# Altium project S7.PrjPCB (part 2 of 3)

## Sheet S7_RF.SchDoc
size A3
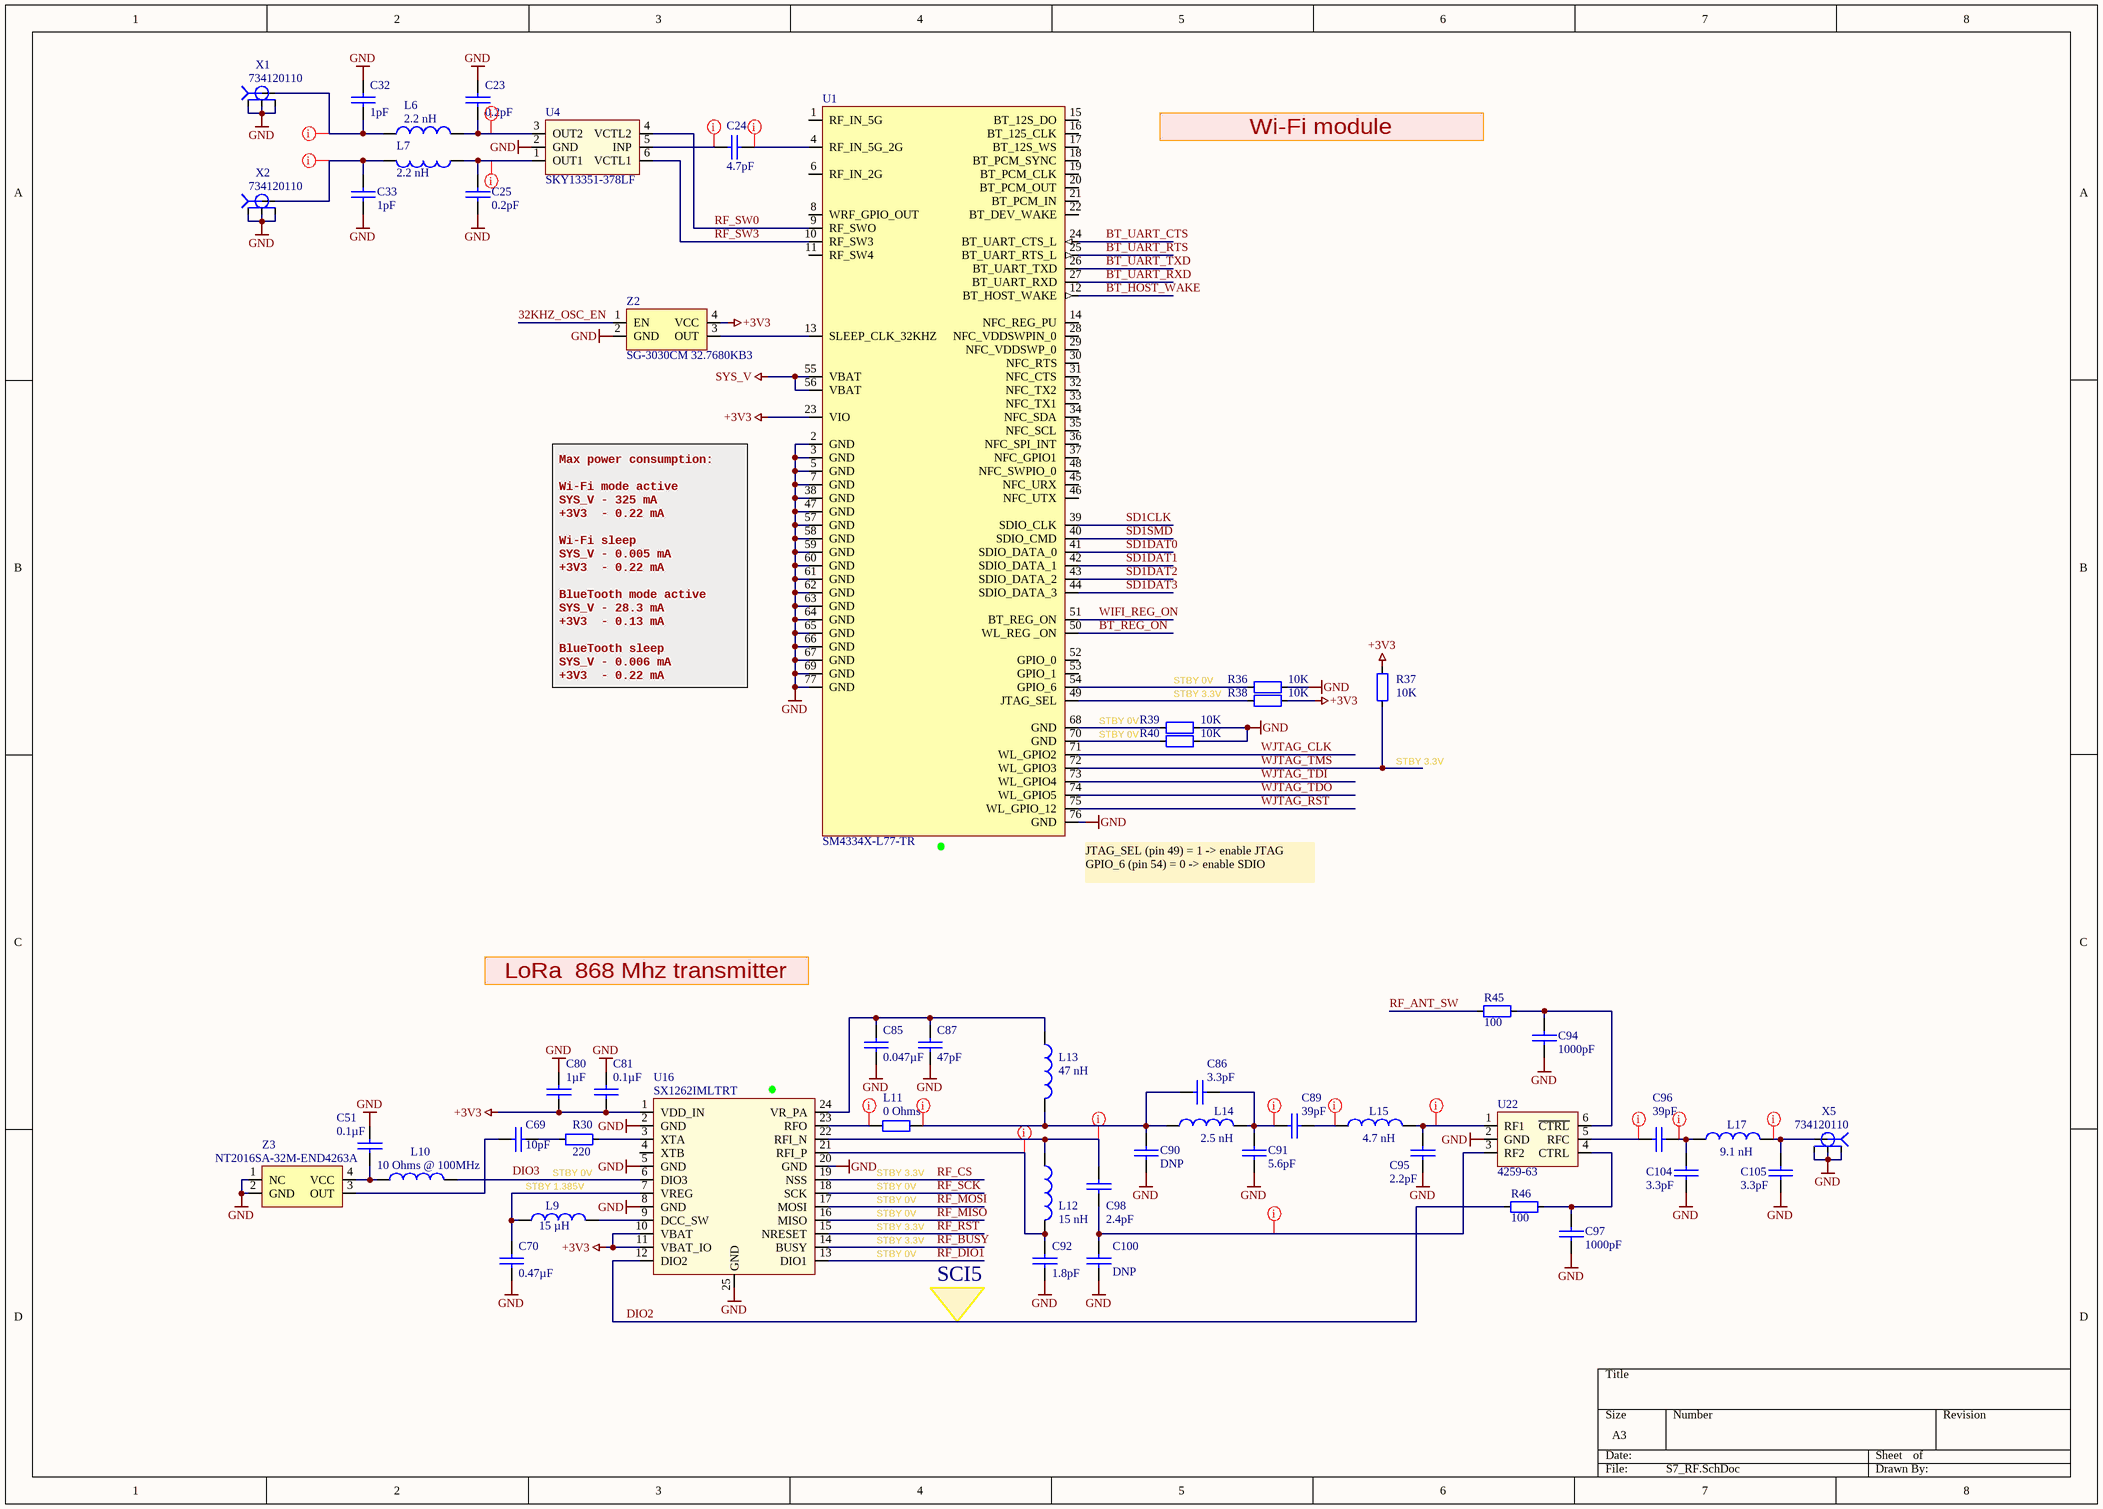
[diagram p2: S7_RF.SchDoc]

### Parts
C23  value 0.2pF  [0402 CAP]  (hidden comment: Capacitor)
C24  value 4.7pF  [0402 CAP]  (hidden comment: Capacitor)
C25  value 0.2pF  [0402 CAP]  (hidden comment: Capacitor)
C32  value 1pF  [0402 CAP]  (hidden comment: Capacitor)
C33  value 1pF  [0402 CAP]  (hidden comment: Capacitor)
C51  value 0.1µF  [0402 CAP]  (hidden comment: Capacitor)
C69  value 10pF  [0402 CAP]  (hidden comment: Capacitor)
C70  value 0.47µF  [0402 CAP]  (hidden comment: Capacitor)
C80  value 1µF  [0402 CAP]  (hidden comment: Capacitor)
C81  value 0.1µF  [0402 CAP]  (hidden comment: Capacitor)
C85  value 0.047µF  [0402 CAP]  (hidden comment: Capacitor)
C86  value 3.3pF  [0402 CAP]  (hidden comment: Capacitor)
C87  value 47pF  [0402 CAP]  (hidden comment: Capacitor)
C89  value 39pF  [0402 CAP]  (hidden comment: Capacitor)
C90  value DNP  [0402 CAP]  (hidden comment: Capacitor_0402)  (no BOM)
C91  value 5.6pF  [0402 CAP]  (hidden comment: Capacitor)
C92  value 1.8pF  [0402 CAP]  (hidden comment: Capacitor)
C94  value 1000pF  [0402 CAP]  (hidden comment: Capacitor)
C95  value 2.2pF  [0402 CAP]  (hidden comment: Capacitor)
C96  value 39pF  [0402 CAP]  (hidden comment: Capacitor)
C97  value 1000pF  [0402 CAP]  (hidden comment: Capacitor)
C98  value 2.4pF  [0402 CAP]  (hidden comment: Capacitor)
C100  value DNP  [0402 CAP]  (hidden comment: Capacitor_0402)  (no BOM)
C104  value 3.3pF  [0402 CAP]  (hidden comment: Capacitor)
C105  value 3.3pF  [0402 CAP]  (hidden comment: Capacitor)
L6  value 2.2 nH  [INDC1005-0402]  (hidden comment: LQP15MN2N2B02D)
L7  value 2.2 nH  [INDC1005-0402]  (hidden comment: LQP15MN2N2B02D)
L9  value 15 µH  [2012[0805]]  (hidden comment: MLZ2012M150WT000)
L10  value 10 Ohms @ 100MHz  [INDC1005-0402]  (hidden comment: BLM15PG100SN1D)
L11  value 0 Ohms  [INDC1005-0402]  (hidden comment: CRCW04020000Z0ED)
L12  value 15 nH  [INDC1005-0402]  (hidden comment: LQW15AN15NH00D)
L13  value 47 nH  [INDC1005-0402]  (hidden comment: LQW15AN47NJ00D)
L14  value 2.5 nH  [INDC1005-0402]  (hidden comment: LQW15AN2N5C00D)
L15  value 4.7 nH  [INDC1005-0402]  (hidden comment: LQW15AN4N7C00D)
L17  value 9.1 nH  [INDC1005-0402]  (hidden comment: LQW15AN9N1H00D)
R30  value 220  [0402]  (hidden comment: Resistor)
R36  value 10K  [0402]  (hidden comment: MCR01MZPJ103)
R37  value 10K  [0402]  (hidden comment: MCR01MZPJ103)
R38  value 10K  [0402]  (hidden comment: MCR01MZPJ103)
R39  value 10K  [0402]  (hidden comment: MCR01MZPJ103)
R40  value 10K  [0402]  (hidden comment: MCR01MZPJ103)
R45  value 100  [0402]  (hidden comment: Resistor)
R46  value 100  [0402]  (hidden comment: Resistor)
U1  SM4334X-L77-TR  [ISM43340-L77-TR]
U4  SKY13351-378LF  [SKY13351-378LF]
U16  SX1262IMLTRT  [VQFN24]
U22  4196  [SC70-6]  (value not drawn)
X1  734120110  [0734120110]
X2  734120110  [0734120110]
X5  734120110  [0734120110]
Z2  SG-3030CM 32.7680KB3  [SG-3030CM]
Z3  NT2016SA-32M-END4263A  [4-SMD 2.00mm x 1.60mm]

### Nets
+3V3: C80.2 C81.2 R37.2 R38.1 U1.23(VIO) U16.1(VDD_IN) U16.10(VBAT) U16.11(VBAT_IO) Z2.4(VCC)
GND: C23.1 C25.1 C32.1 C33.1 C51.1 C70.2 C80.1 C81.1 C85.2 C87.2 C90.2 C91.2 C92.2 C94.1 C95.2 C97.1 C100.2 C104.1 C105.1 R36.1 R39.1 R40.1 U1.2(GND) U1.3(GND) U1.5(GND) U1.7(GND) U1.38(GND) U1.47(GND) U1.57(GND) U1.58(GND) U1.59(GND) U1.60(GND) U1.61(GND) U1.62(GND) U1.63(GND) U1.64(GND) U1.65(GND) U1.66(GND) U1.67(GND) U1.69(GND) U1.76(GND) U1.77(GND) U4.2(GND) U16.2(GND) U16.5(GND) U16.8(GND) U16.20(GND) U16.25(GND) U22.2(GND) X1.2 X1.3 X1.4 X2.2 X2.3 X2.4 X5.2 X5.3 X5.4 Z2.2(GND) Z3.1(NC) Z3.2(GND)
SYS_V: U1.55(VBAT) U1.56(VBAT)
32KHZ_OSC_EN: Z2.1(EN)
BT_HOST_WAKE: U1.12(BT_HOST_WAKE)
BT_REG_ON: U1.50(WL_REG__ON)
BT_UART_CTS: U1.24(BT_UART_CTS_L)
BT_UART_RTS: U1.25(BT_UART_RTS_L)
BT_UART_RXD: U1.27(BT_UART_RXD)
BT_UART_TXD: U1.26(BT_UART_TXD)
DIO2: R46.2 U16.12(DIO2)
RF_ANT_SW: R45.2
RF_BUSY: U16.14(BUSY)
RF_CS: U16.19(NSS)
RF_DIO1: U16.13(DIO1)
RF_MISO: U16.16(MISO)
RF_MOSI: U16.17(MOSI)
RF_RST: U16.15(NRESET)
RF_SCK: U16.18(SCK)
RF_SW0: U1.9(RF_SWO) U4.4(VCTL2)
RF_SW3: U1.10(RF_SW3) U4.6(VCTL1)
SD1CLK: U1.39(SDIO_CLK)
SD1DAT0: U1.41(SDIO_DATA_0)
SD1DAT1: U1.42(SDIO_DATA_1)
SD1DAT2: U1.43(SDIO_DATA_2)
SD1DAT3: U1.44(SDIO_DATA_3)
SD1SMD: U1.40(SDIO_CMD)
WIFI_REG_ON: U1.51(BT_REG_ON)
WJTAG_CLK: U1.71(WL_GPIO2)
WJTAG_RST: U1.75(WL_GPIO_12)
WJTAG_TDI: U1.73(WL_GPIO4)
WJTAG_TDO: U1.74(WL_GPIO5)
WJTAG_TMS: R37.1 U1.72(WL_GPIO3)
NetC23_2: C23.2 L6.2 U4.3(OUT2)
NetC24_1: C24.1 U4.5(INP)
NetC24_2: C24.2 U1.4(RF_IN_5G_2G)
NetC25_2: C25.2 L7.2 U4.1(OUT1)
NetC32_2: C32.2 L6.1 X1.1(Sig)
NetC33_2: C33.2 L7.1 X2.1(Sig)
NetC51_2: C51.2 L10.1 Z3.4(VCC)
NetC69_1: C69.1 Z3.3(OUT)
NetC69_2: C69.2 R30.1
NetC70_1: C70.1 L9.1 U16.7(VREG)
NetC85_1: C85.1 C87.1 L13.1 U16.24(VR_PA)
NetC86_1: C86.1 C90.1 L11.2 L13.2 L14.1
NetC86_2: C86.2 C89.1 C91.1 L14.2
NetC89_2: C89.2 L15.1
NetC92_1: C92.1 L12.2 U16.21(RFI_P)
NetC94_2: C94.2 R45.1 U22.6(~{CTRL})
NetC95_1: C95.1 L15.2 U22.1(RF1)
NetC96_1: C96.1 U22.5(RFC)
NetC96_2: C96.2 C104.2 L17.1
NetC97_2: C97.2 R46.1 U22.4(CTRL)
NetC98_1: C98.1 L12.1 U16.22(RFI_N)
NetC98_2: C98.2 C100.1 U22.3(RF2)
NetC105_2: C105.2 L17.2 X5.1(Sig)
NetL9_2: L9.2 U16.9(DCC_SW)
NetL10_2: L10.2 U16.6(DIO3)
NetL11_1: L11.1 U16.23(RFO)
NetR30_2: R30.2 U16.3(XTA)
NetR36_2: R36.2 U1.54(GPIO_6)
NetR38_2: R38.2 U1.49(JTAG_SEL)
NetR39_2: R39.2 U1.68(GND)
NetR40_2: R40.2 U1.70(GND)
NetU1_13: U1.13(SLEEP_CLK_32KHZ) Z2.3(OUT)

Not connected (* = marked no-connect by the designer): U1 1(RF_IN_5G) 6(RF_IN_2G) 8(WRF_GPIO_OUT) 11(RF_SW4) 14(NFC_REG_PU) 15(BT_12S_DO) 16(BT_125_CLK) 17(BT_12S_WS) 18(BT_PCM_SYNC) 19(BT_PCM_CLK) 20(BT_PCM_OUT) 21(BT_PCM_IN) 22(BT_DEV_WAKE) 28(NFC_VDDSWPIN_0) 29(NFC_VDDSWP_0) 30(NFC_RTS) 31(NFC_CTS) 32(NFC_TX2) 33(NFC_TX1) 34(NFC_SDA) 35(NFC_SCL) 36(NFC_SPI_INT) 37(NFC_GPIO1) 45(NFC_URX) 46(NFC_UTX) 48(NFC_SWPIO_0) 52(GPIO_0) 53(GPIO_1); U16 4(XTB)

### Layout directives
net class RF: NetC23_2, NetC24_1, NetC24_2, NetC25_2, NetC32_2, NetC33_2, NetC86_1, NetC86_2, NetC89_2, NetC92_1, NetC95_1, NetC96_1, NetC96_2, NetC98_1, NetC98_2, NetC105_2, NetL11_1

### Notes on the sheet
- Wi-Fi module
- Max power consumption:
  Wi-Fi mode active
  SYS_V - 325 mA
  +3V3  - 0.22 mA
  Wi-Fi sleep
  SYS_V - 0.005 mA
  +3V3  - 0.22 mA
  BlueTooth mode active
  SYS_V - 28.3 mA
  +3V3  - 0.13 mA
  BlueTooth sleep
  SYS_V - 0.006 mA
  +3V3  - 0.22 mA
- STBY 0V
- STBY 3.3V
- (near U1) JTAG_SEL (pin 49) = 1 -> enable JTAG
  GPIO_6 (pin 54) = 0 -> enable SDIO
- LoRa  868 Mhz transmitter
- STBY 1.385V
- SCI5
- Labels drawn without touching a wire or pin: DIO3

### Library data of the parts
C23 C25 = 500R07S0R2BV4T: 0.2pF, ±0.1pF, 50V, C0G, NP0, 0402 (1005 Metric), -55°C ~ 125°C, High Q, Low Loss, Ultra Low ESR, RF, Microwave, High Frequency; Manufacturer: Johanson Technology Inc.; PartNum: 712-1160-1-ND; Voltage - Rated: 50V; Part Number: 500R07S0R2BV4T; Distributor: Digi-Key; PartName: 500R07S0R2BV4T; Price: 0.16000; Tolerance: ±0.1pF; Temperature Coefficient: C0G, NP0; Operating Temperature: -55°C ~ 125°C; Features: High Q, Low Loss, Ultra Low ESR; Package / Case: 0402 (1005 Metric)
C24 = 500R07S4R7CV4T: 4.7pF, ±0.25pF, 50V, C0G, NP0, 0402 (1005 Metric), -55°C ~ 125°C, High Q, Low Loss, Ultra Low ESR, RF, Microwave, High Frequency; Manufacturer: Johanson Technology Inc.; PartNum: 712-1287-1-ND; Voltage - Rated: 50V; Part Number: 500R07S4R7CV4T; Distributor: Digi-Key; PartName: 500R07S4R7CV4T; Price: 0.19000; Tolerance: ±0.25pF; Temperature Coefficient: C0G, NP0; Operating Temperature: -55°C ~ 125°C; Features: High Q, Low Loss, Ultra Low ESR; Package / Case: 0402 (1005 Metric)
C32 C33 = GJM1555C1H1R0CB01D: 1pF, ±0.25pF, 50V, C0G, NP0, 0402 (1005 Metric), -55°C ~ 125°C, High Q, Low Loss, RF, Microwave, High Frequency; Manufacturer: Murata Electronics North America; PartNum: 490-3083-1-ND; Voltage - Rated: 50V; Part Number: GJM1555C1H1R0CB01D; Distributor: Digi-Key; PartName: GJM1555C1H1R0CB01D; Price: 0.12000; Tolerance: ±0.25pF; Temperature Coefficient: C0G, NP0; Operating Temperature: -55°C ~ 125°C; Features: High Q, Low Loss; Package / Case: 0402 (1005 Metric)
C51 C81 = 0402B104K500CT: as C4 on sheet S7_Power; Voltage - Rated: 50V; Part Number: 0402B104K500CT; Distributor: Digi-Key; PartName: 0402B104K500CT; Price: 0.19000; Tolerance: ±10%; Temperature Coefficient: X7R; Operating Temperature: -55°C ~ 125°C; Features: -; Package / Case: 0402 (1005 Metric)
C69 = GJM1555C1H100FB01D: 10pF, ±1%, 50V, C0G, NP0, 0402 (1005 Metric), -55°C ~ 125°C, High Q, Low Loss, RF, Microwave, High Frequency; Manufacturer: Murata Electronics North America; PartNum: 490-11189-1-ND; Voltage - Rated: 50V; Part Number: GJM1555C1H100FB01D; Distributor: Digi-Key; PartName: GJM1555C1H100FB01D; Price: 0.28000; Tolerance: ±1%; Temperature Coefficient: C0G, NP0; Operating Temperature: -55°C ~ 125°C; Features: High Q, Low Loss; Package / Case: 0402 (1005 Metric)
C70 = GRT155R61E474ME01D: 0.47µF, ±20%, 25V, X5R, 0402 (1005 Metric), -55°C ~ 85°C, -, Automotive; Manufacturer: Murata Electronics North America; PartNum: 490-12270-1-ND; Voltage - Rated: 25V; Part Number: GRT155R61E474ME01D; Distributor: Digi-Key; PartName: GRT155R61E474ME01D; Price: 0.13000; Tolerance: ±20%; Temperature Coefficient: X5R; Operating Temperature: -55°C ~ 85°C; Features: -; Package / Case: 0402 (1005 Metric)
C80 = TMK105BJ105MV-F: 1µF, ±20%, 25V, X5R, 0402 (1005 Metric), -55°C ~ 85°C, -, General Purpose; Manufacturer: Taiyo Yuden; PartNum: 587-3245-1-ND; Voltage - Rated: 25V; Part Number: TMK105BJ105MV-F; Distributor: Digi-Key; PartName: TMK105BJ105MV-F; Price: 0.22000; Tolerance: ±20%; Temperature Coefficient: X5R; Operating Temperature: -55°C ~ 85°C; Features: -; Package / Case: 0402 (1005 Metric)
C85 = CC0402KRX7R8BB473: 0.047µF, ±10%, 25V, X7R, 0402 (1005 Metric), -55°C ~ 125°C, -, General Purpose; Manufacturer: Yageo; PartNum: 311-1717-1-ND; Voltage - Rated: 25V; Part Number: CC0402KRX7R8BB473; Distributor: Digi-Key; PartName: CC0402KRX7R8BB473; Price: 0.10000; Tolerance: ±10%; Temperature Coefficient: X7R; Operating Temperature: -55°C ~ 125°C; Features: -; Package / Case: 0402 (1005 Metric)
C86 C104 C105 = 885392005011: 3.3pF, ±0.1pF, 50V, C0G, NP0, 0402 (1005 Metric), -55°C ~ 125°C, -, RF, Microwave, High Frequency; Manufacturer: Wurth Electronics Inc.; PartNum: 732-13236-1-ND; Voltage - Rated: 50V; Part Number: 885392005011; Distributor: Digi-Key; PartName: 885392005011; Price: 0.10000; Tolerance: ±0.1pF; Temperature Coefficient: C0G, NP0; Operating Temperature: -55°C ~ 125°C; Features: -; Package / Case: 0402 (1005 Metric)
C87 = GJM1555C1H470FB01D: 47pF, ±1%, 50V, C0G, NP0, 0402 (1005 Metric), -55°C ~ 125°C, High Q, Low Loss, RF, Microwave, High Frequency; Manufacturer: Murata Electronics North America; PartNum: 490-16376-1-ND; Voltage - Rated: 50V; Part Number: GJM1555C1H470FB01D; Distributor: Digi-Key; PartName: GJM1555C1H470FB01D; Price: 0.28000; Tolerance: ±1%; Temperature Coefficient: C0G, NP0; Operating Temperature: -55°C ~ 125°C; Features: High Q, Low Loss; Package / Case: 0402 (1005 Metric)
C89 C96 = GJM1555C1H390JB01D: 39pF, ±5%, 50V, C0G, NP0, 0402 (1005 Metric), -55°C ~ 125°C, High Q, Low Loss, RF, Microwave, High Frequency; Manufacturer: Murata Electronics North America; PartNum: 490-17673-1-ND; Voltage - Rated: 50V; Part Number: GJM1555C1H390JB01D; Distributor: Digi-Key; PartName: GJM1555C1H390JB01D; Price: 0.24000; Tolerance: ±5%; Temperature Coefficient: C0G, NP0; Operating Temperature: -55°C ~ 125°C; Features: High Q, Low Loss; Package / Case: 0402 (1005 Metric)
C91 = GJM1555C1H5R6BB01D: 5.6pF, ±0.1pF, 50V, C0G, NP0, 0402 (1005 Metric), -55°C ~ 125°C, High Q, Low Loss, RF, Microwave, High Frequency; Manufacturer: Murata Electronics North America; PartNum: 490-11225-1-ND; Voltage - Rated: 50V; Part Number: GJM1555C1H5R6BB01D; Distributor: Digi-Key; PartName: GJM1555C1H5R6BB01D; Price: 0.19000; Tolerance: ±0.1pF; Temperature Coefficient: C0G, NP0; Operating Temperature: -55°C ~ 125°C; Features: High Q, Low Loss; Package / Case: 0402 (1005 Metric)
C92 = GJM1555C1H1R8BB01D: 1.8pF, ±0.1pF, 50V, C0G, NP0, 0402 (1005 Metric), -55°C ~ 125°C, High Q, Low Loss, RF, Microwave, High Frequency; Manufacturer: Murata Electronics North America; PartNum: 490-8089-1-ND; Voltage - Rated: 50V; Part Number: GJM1555C1H1R8BB01D; Distributor: Digi-Key; PartName: GJM1555C1H1R8BB01D; Price: 0.19000; Tolerance: ±0.1pF; Temperature Coefficient: C0G, NP0; Operating Temperature: -55°C ~ 125°C; Features: High Q, Low Loss; Package / Case: 0402 (1005 Metric)
C94 C97 = C1005CH1H102J050BA: 1000pF, ±5%, 50V, CH, 0402 (1005 Metric), -25°C ~ 85°C, Low ESL, General Purpose; Manufacturer: TDK Corporation; PartNum: 445-10829-1-ND; Voltage - Rated: 50V; Part Number: C1005CH1H102J050BA; Distributor: Digi-Key; PartName: C1005CH1H102J050BA; Price: 0.19000; Tolerance: ±5%; Temperature Coefficient: CH; Operating Temperature: -25°C ~ 85°C; Features: Low ESL; Package / Case: 0402 (1005 Metric)
C95 = CBR04C229B5GAC: 2.2pF, ±0.1pF, 50V, C0G, NP0, 0402 (1005 Metric), -55°C ~ 125°C, High Q, Low Loss, RF, Microwave, High Frequency; Manufacturer: KEMET; PartNum: 399-17527-1-ND; Voltage - Rated: 50V; Part Number: CBR04C229B5GAC; Distributor: Digi-Key; PartName: CBR04C229B5GAC; Price: 0.19000; Tolerance: ±0.1pF; Temperature Coefficient: C0G, NP0; Operating Temperature: -55°C ~ 125°C; Features: High Q, Low Loss; Package / Case: 0402 (1005 Metric)
C98 = GJM1555C1H2R4BB01D: 2.4pF, ±0.1pF, 50V, C0G, NP0, 0402 (1005 Metric), -55°C ~ 125°C, High Q, Low Loss, RF, Microwave, High Frequency; Manufacturer: Murata Electronics North America; PartNum: 490-8093-1-ND; Voltage - Rated: 50V; Part Number: GJM1555C1H2R4BB01D; Distributor: Digi-Key; PartName: GJM1555C1H2R4BB01D; Price: 0.19000; Tolerance: ±0.1pF; Temperature Coefficient: C0G, NP0; Operating Temperature: -55°C ~ 125°C; Features: High Q, Low Loss; Package / Case: 0402 (1005 Metric)
L6 L7 = LQP15MN2N2B02D: 2.2nH ±0.1nH, Q=13 @ 500MHz, 6GHz, Inductor 220mA 300 mOhm Max, -40°C ~ 85°C, 0402; Manufacturer: Murata Electronics North America; PartNum: 490-1128-1-ND; Tolerance: ±0.1nH; Distributor: Digi-Key; PartName: LQP15MN2N2B02D
L9 = MLZ2012M150WT000: 15µH Shielded Multilayer Inductor 250mA 950 mOhm 0805 (2012 Metric); Manufacturer: TDK Corporation; PartNum: 445-6397-1-ND; Tolerance: ±20%; Distributor: Digi-Key; Price: 0.14$; PartName: MLZ2012M150WT000
L10 = BLM15PG100SN1D: 10 Ohms @ 100MHz 1 Power Line Ferrite Bead 0402 (1005 Metric) 1A 25 mOhm; Manufacturer: Murata Electronics North America; PartNum: 490-5976-1-ND; Price: 0.12$; Distributor: Digi-Key; PartName: BLM15PG100SN1D
L11 = CRCW04020000Z0ED: 0 Ohms Jumper 0.063W, 1/16W Chip Resistor 0402 (1005 Metric) Automotive AEC-Q200 Thick Film; Manufacturer: Vishay Dale; PartNum: 541-0.0JCT-ND; Distributor: Digi-Key; PartName: CRCW04020000Z0ED
L12 = LQW15AN15NH00D: 15nH Unshielded Wirewound Inductor 460mA 160 mOhm Max 0402 (1006 Metric); Manufacturer: Murata; PartNum: 490-6772-1-ND; Tolerance: ±3%; Distributor: Digi-Key; PartName: LQW15AN15NH00D
L13 = LQW15AN47NJ00D: 47nH Unshielded Wirewound Inductor 210mA 1.08 Ohm Max 0402 (1005 Metric); Manufacturer: Murata; PartNum: 490-1154-1-ND; Tolerance: ±5%; Distributor: Digi-Key; PartName: LQW15AN47NJ00D
L14 = LQW15AN2N5C00D: 2.5nH Unshielded Wirewound Inductor 850mA 50 mOhm Max 0402 (1006 Metric); Manufacturer: Murata; PartNum: 490-6798-1-ND; Tolerance: ±0.2nH; Distributor: Digi-Key; PartName: LQW15AN2N5C00D
L15 = LQW15AN4N7C00D: 4.7nH Unshielded Wirewound Inductor 750mA 70 mOhm Max 0402 (1006 Metric); Manufacturer: Murata Electronics North America; PartNum: 490-1139-1-ND; Tolerance: ±0.2nH; Distributor: Digi-Key; PartName: LQW15AN4N7C00D
L17 = LQW15AN9N1H00D: 9.1nH Unshielded Wirewound Inductor 540mA 140 mOhm Max 0402 (1006 Metric); Manufacturer: Murata Electronics North America; PartNum: 490-8444-1-ND; Tolerance: ±3%; Distributor: Digi-Key; PartName: LQW15AN9N1H00D
R30 = RC0402FR-07220RL: 220 Ohms, ±1%, 0.063W, 1/16W, Thick Film, ±100ppm/°C, 0402 (1005 Metric), -55°C ~ 155°C, Moisture Resistant; Manufacturer: Yageo; PartNum: 311-220LRCT-ND; Voltage: 75V; Distributor: Digi-Key; Price: 0.10000; Tolerance: ±1%; PartName: RC0402FR-07220RL; Part Number: RC0402FR-07220RL; Temperature Coefficient: ±100ppm/°C; Operating Temperature: -55°C ~ 155°C; Power (Watts): 0.063W, 1/16W; Features: Moisture Resistant; Package / Case: 0402 (1005 Metric)
R36-R40 = MCR01MZPJ103: 10 K, 0402, Thick Film, -55..+155; Manufacturer: Rohm Semiconductor; PartNum: RHM10KJTR-ND; Tolerance: 5%; Distributor: Digi-Key; Price: 0.1$; PartName: MCR01MZPJ103
R45 R46 = RMCF0402FT100R: 100 Ohms, ±1%, 0.063W, 1/16W, Thick Film, ±100ppm/°C, 0402 (1005 Metric), -55°C ~ 155°C, Automotive AEC-Q200; Manufacturer: Stackpole Electronics Inc; PartNum: RMCF0402FT100RCT-ND; Voltage: 75V; Distributor: Digi-Key; Price: 0.10000; Tolerance: ±1%; PartName: RMCF0402FT100R; Part Number: RMCF0402FT100R; Temperature Coefficient: ±100ppm/°C; Operating Temperature: -55°C ~ 155°C; Power (Watts): 0.063W, 1/16W; Features: Automotive AEC-Q200; Package / Case: 0402 (1005 Metric)
U1 = SM4334X-L77-TR: Bluetooth, WiFi 802.11a/b/g/n, Bluetooth v4.0 Transceiver Module 2.4GHz, 5GHz Integrated, Trace + U.FL Surface Mount; PartNum: 1475-1047-1-ND; Nanufacturer: Inventek Systems; PartName: SM4334X-L77-TR; Distributor: Digi-Key
U4 = SKY13351-378LF: RF Switch IC 802.11/WiFi, WLAN SPDT 6GHz 50 Ohm, -40°C ~ 85°C, 6-MLPD (1x1); Manufacturer: Skyworks Solutions Inc.; PartNum: 863-1177-1-ND; Price: 089$; Distributor: Digi-Key; PartName: SKY13351-378LF
U16 = SX1262IMLTRT: IC RF TxRx Only General ISM < 1GHz LoRaWAN 150MHz ~ 960MHz 24-VFQFN Exposed Pad; Manufacturer: Semtech Corporation; PartName: SX1262IMLTRTCT-ND; Distributor: Digi-Key; PartNum: SX1262IMLTRT; Price: 7.94$
U22 = 4259-63: RF Switch IC General Purpose SPDT 3GHz 50 Ohm SC-70-6; Manufacturer: pSemi; PartNum: 1046-1011-2-ND; Distributor: Digi-Key; PartName: 4259-63
X1 X2 X5 = 0734120110: U.FL (UMCC) Connector Receptacle, Male Pin 50 Ohm Surface Mount Solder; Manufacturer: Molex; PartNum: WM5587TR-ND; Distributor: Digi-Key; PartName: 0734120110
Z2 = SG-3030CM 32.7680KB3: 32.768kHz XO (Standard) CMOS Oscillator 1.5V ~ 5.5V, -20°C ~ 70°C, 4-SMD  (3.20mm x 1.50mm); Manufacturer: EPSON; PartNum: SER4328CT-ND; Distributor: DigiKey; Price: 1.6$; Value: 32.768 kHz; PartName: SG-3030CM 32.7680KB3
Z3 = NT2016SA-32M-END4263A: 32MHz VCTCXO Oscillator 1.8V 4-SMD, No Lead; Manufacturer: NDK America, Inc.; PartNum: 644-1328-1-ND; Tolerance: ±2ppm; Distributor: Digi-Key; Price: 1.6$; Value: 32 MHz; PartName: NT2016SA-32M-END4263A

## Sheet S7_Audio_IMU_uSD.SchDoc
size A3
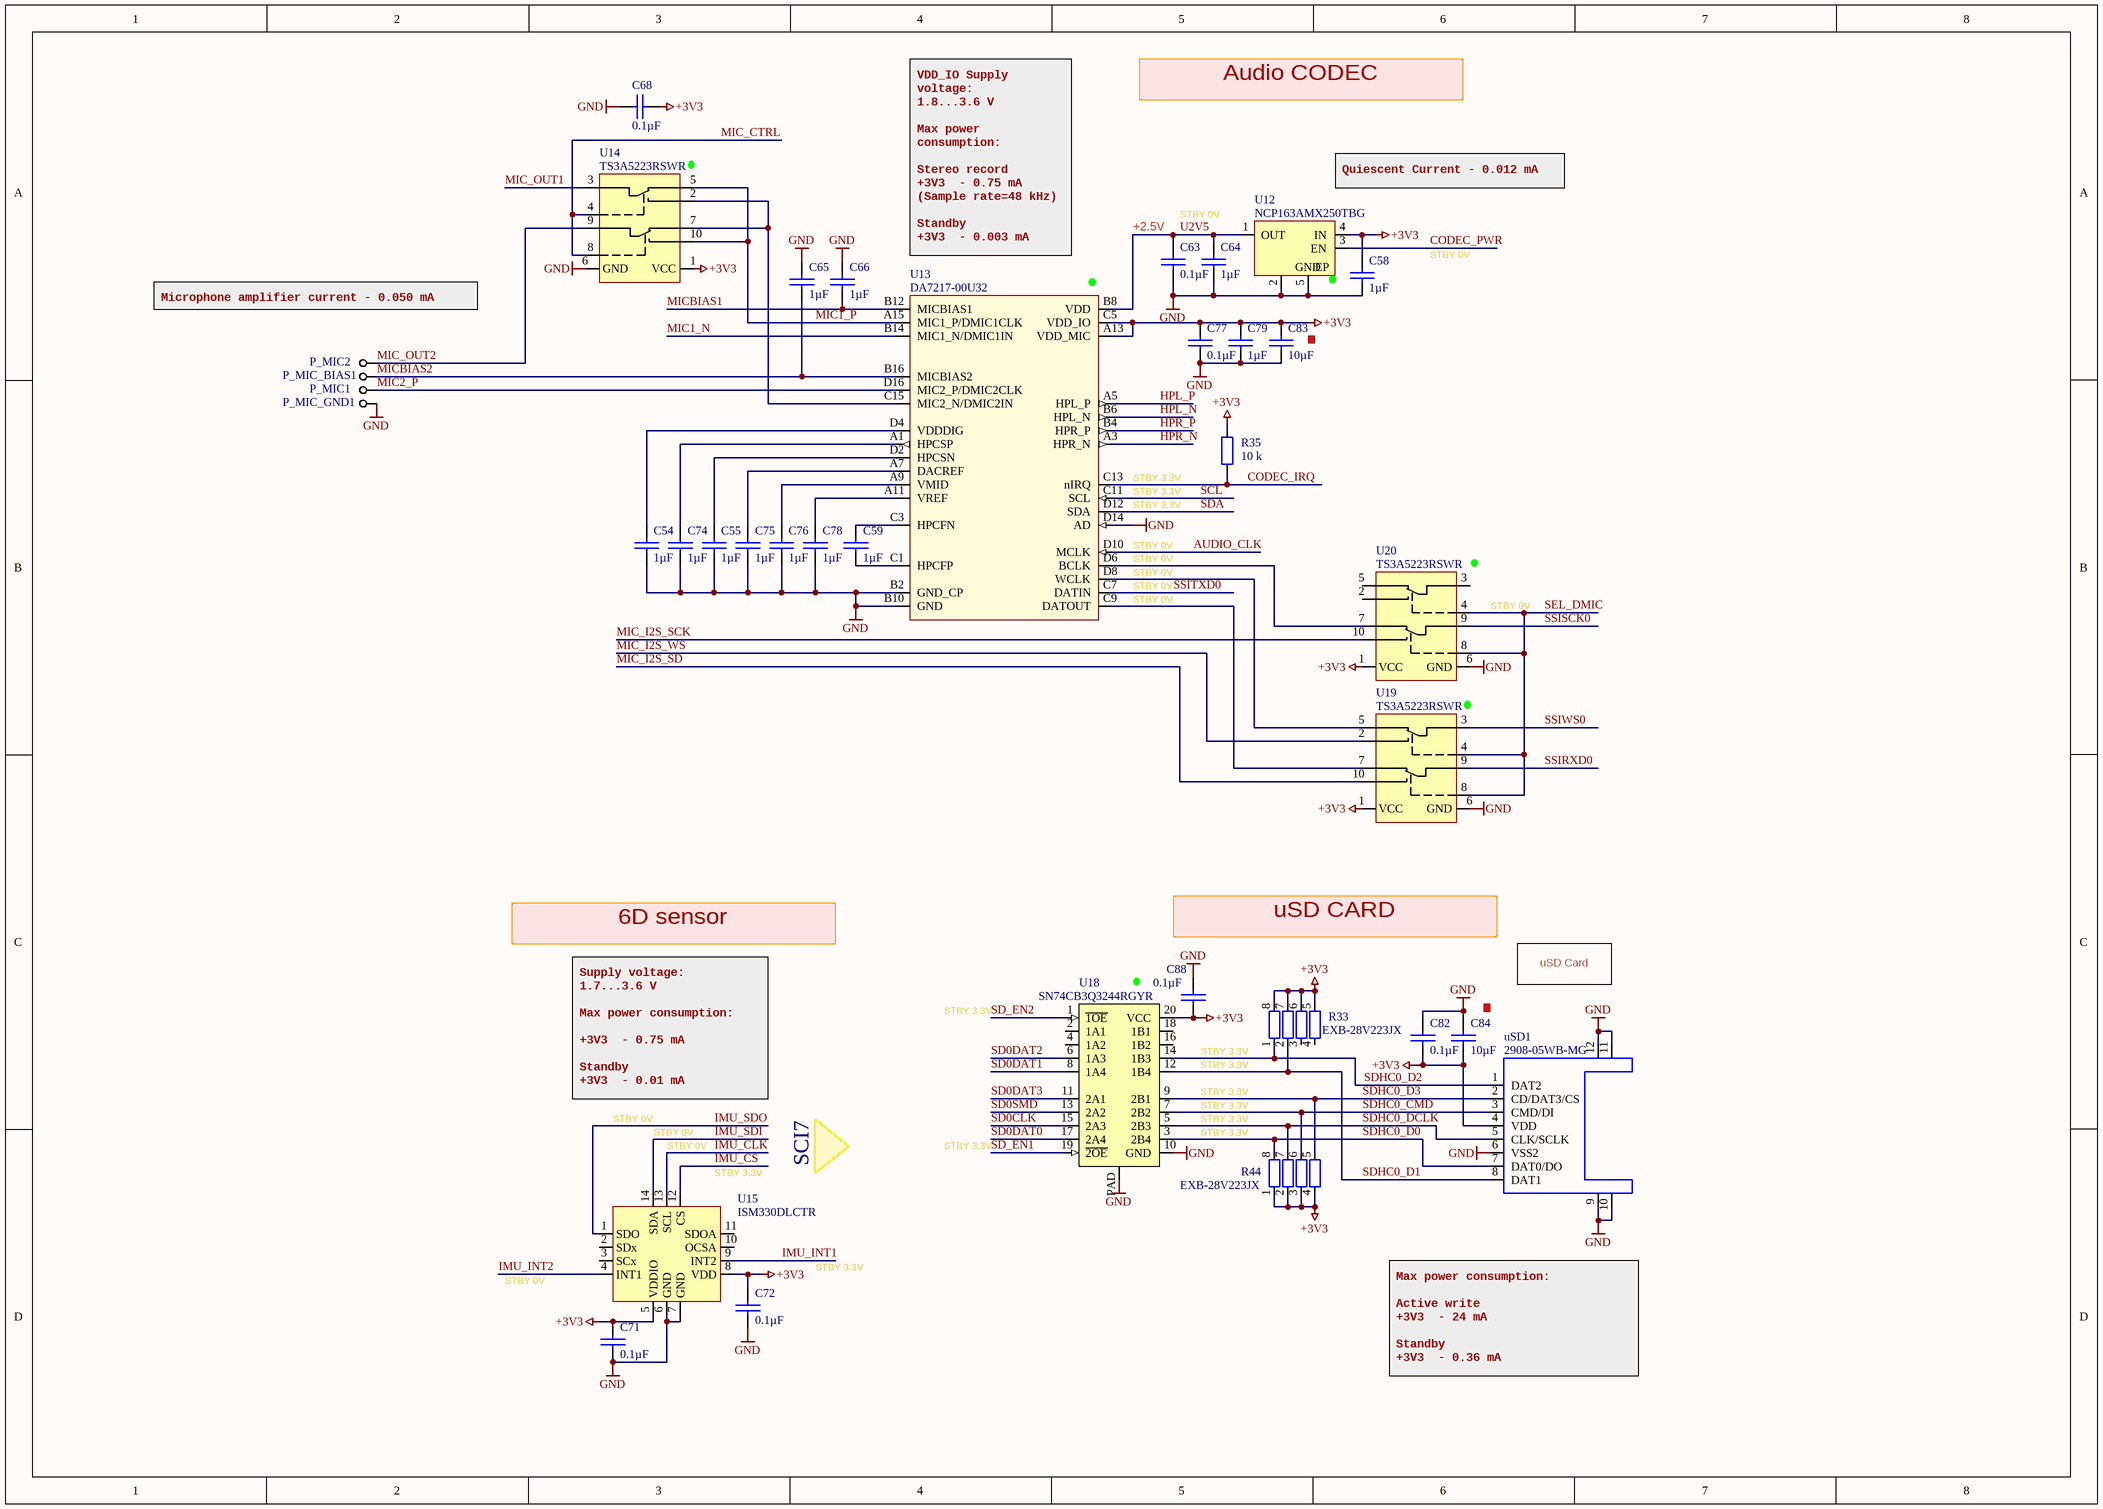
[diagram p3: S7_Audio_IMU_uSD.SchDoc]

### Parts
C54  value 1µF  [0402 CAP]  (hidden comment: Capacitor)
C55  value 1µF  [0402 CAP]  (hidden comment: Capacitor)
C58  value 1µF  [0402 CAP]  (hidden comment: Capacitor)
C59  value 1µF  [0402 CAP]  (hidden comment: Capacitor)
C63  value 0.1µF  [0402 CAP]  (hidden comment: Capacitor)
C64  value 1µF  [0402 CAP]  (hidden comment: Capacitor)
C65  value 1µF  [0402 CAP]  (hidden comment: Capacitor)
C66  value 1µF  [0402 CAP]  (hidden comment: Capacitor)
C68  value 0.1µF  [0402 CAP]  (hidden comment: Capacitor)
C71  value 0.1µF  [0402 CAP]  (hidden comment: Capacitor)
C72  value 0.1µF  [0402 CAP]  (hidden comment: Capacitor)
C74  value 1µF  [0402 CAP]  (hidden comment: Capacitor)
C75  value 1µF  [0402 CAP]  (hidden comment: Capacitor)
C76  value 1µF  [0402 CAP]  (hidden comment: Capacitor)
C77  value 0.1µF  [0402 CAP]  (hidden comment: Capacitor)
C78  value 1µF  [0402 CAP]  (hidden comment: Capacitor)
C79  value 1µF  [0402 CAP]  (hidden comment: Capacitor)
C82  value 0.1µF  [0402 CAP]  (hidden comment: Capacitor)
C83  value 10µF  [0603 CAP]  (hidden comment: Capacitor)
C84  value 10µF  [0603 CAP]  (hidden comment: Capacitor)
C88  value 0.1µF  [0402 CAP]  (hidden comment: Capacitor)
P_MIC1  PIN_TOP_1.5x2  [PIN_TOP_1.5x2]  (value not drawn)  (net tie, no BOM)
P_MIC2  PIN_TOP_1.5x2  [PIN_TOP_1.5x2]  (value not drawn)  (net tie, no BOM)
P_MIC_BIAS1  PIN_TOP_1.5x2  [PIN_TOP_1.5x2]  (value not drawn)  (net tie, no BOM)
P_MIC_GND1  PIN_TOP_1.5x2  [PIN_TOP_1.5x2]  (value not drawn)  (net tie, no BOM)
R33  EXB-28V223JX  [EXB28V 2x1 mm]
R35  value 10 k  [0402]  (hidden comment: Resistor)
R44  EXB-28V223JX  [EXB28V 2x1 mm]
U12  NCP163AMX250TBG  [4-XDFN]
U13  DA7217-00U32  [Dilaog 34-WLCSP (4.57x1.98)]
U14  TS3A5223RSWR  [uQFN-10]
U15  ISM330DLCTR  [LGA-14 BOSCH]
U18  SN74CB3Q3244RGYR  [TI_PVQFN-N20]
U19  TS3A5223RSWR  [uQFN-10]
U20  TS3A5223RSWR  [uQFN-10]
uSD1  2908-05WB-MG  [2908-05WB-MG]

### Nets
+3V3: C58.1 C68.2 C71.1 C72.1 C77.1 C79.1 C82.2 C83.1 C84.2 C88.2 R33.5 R33.6 R33.7 R33.8 R35.2 R44.1 R44.2 R44.3 R44.4 U12.4(IN) U13.A13(VDD_MIC) U13.C5(VDD_IO) U14.1(VCC) U15.5(VDDIO) U15.8(VDD) U18.20(VCC) U19.1(VCC) U20.1(VCC) uSD1.4(VDD)
GND: C54.2 C55.2 C58.2 C63.2 C64.2 C65.1 C66.1 C68.1 C71.2 C72.2 C74.2 C75.2 C76.2 C77.2 C78.2 C79.2 C82.1 C83.2 C84.1 C88.1 P_MIC_GND1.1 U12.2(GND) U12.5(EP) U13.B2(GND_CP) U13.B10(GND) U13.D14(AD) U14.6(GND) U15.6(GND) U15.7(GND) U18.10(GND) U18.PAD U19.6(GND) U20.6(GND) uSD1.6(VSS2) uSD1.9 uSD1.10(WP) uSD1.11(GND) uSD1.12(GND)
AUDIO_CLK: U13.D10(MCLK)
CODEC_IRQ: R35.1 U13.C13(nIRQ)
CODEC_PWR: U12.3(EN)
HPL_N: U13.B6(HPL_N)
HPL_P: U13.A5(HPL_P)
HPR_N: U13.A3(HPR_N)
HPR_P: U13.B4(HPR_P)
IMU_CLK: U15.13(SCL)
IMU_CS: U15.12(CS)
IMU_INT1: U15.9(INT2)
IMU_INT2: U15.4(INT1)
IMU_SDI: U15.14(SDA)
IMU_SDO: U15.1(SDO)
MIC1_N: U13.B14(MIC1_N/DMIC1IN)
MIC1_P: U13.A15(MIC1_P/DMIC1CLK) U14.5(NC1) U14.10(NO2)
MIC2_P: P_MIC1.1 U13.D16(MIC2_P/DMIC2CLK)
MIC_CTRL: U14.4(SEL1) U14.8(SEL2)
MIC_I2S_SCK: U20.10(NO2)
MIC_I2S_SD: U19.10(NO2)
MIC_I2S_WS: U19.2(NO1)
MIC_OUT1: U14.3(COM1)
MIC_OUT2: P_MIC2.1 U14.9(COM2)
MICBIAS1: C66.2 U13.B12(MICBIAS1)
MICBIAS2: C65.2 P_MIC_BIAS1.1 U13.B16(MICBIAS2)
SCL: U13.C11(SCL)
SD0CLK: U18.15(2A3)
SD0DAT0: U18.17(2A4)
SD0DAT1: U18.8(1A4)
SD0DAT2: U18.6(1A3)
SD0DAT3: U18.11(2A1)
SD0SMD: U18.13(2A2)
SD_EN1: U18.19(~{2OE})
SD_EN2: U18.1(~{1OE})
SDA: U13.D12(SDA)
SDHC0_CMD: R44.6 U18.7(2B2) uSD1.3(CMD/DI)
SDHC0_D0: R44.8 U18.3(2B4) uSD1.7(DAT0/DO)
SDHC0_D1: R33.2 U18.12(1B4) uSD1.8(DAT1)
SDHC0_D2: R33.1 U18.14(1B3) uSD1.1(DAT2)
SDHC0_D3: R44.5 U18.9(2B1) uSD1.2(CD/DAT3/CS)
SDHC0_DCLK: R44.7 U18.5(2B3) uSD1.5(CLK/SCLK)
SEL_DMIC: U19.4(SEL1) U19.8(SEL2) U20.4(SEL1) U20.8(SEL2)
SSIRXD0: U19.9(COM2)
SSISCK0: U20.9(COM2)
SSITXD0: U13.C7(DATIN)
SSIWS0: U19.3(COM1)
U2V5: C63.1 C64.1 U12.1(OUT) U13.B8(VDD)
NetC54_1: C54.1 U13.D4(VDDDIG)
NetC55_1: C55.1 U13.D2(HPCSN)
NetC59_1: C59.1 U13.C3(HPCFN)
NetC59_2: C59.2 U13.C1(HPCFP)
NetC74_1: C74.1 U13.A1(HPCSP)
NetC75_1: C75.1 U13.A7(DACREF)
NetC76_1: C76.1 U13.A9(VMID)
NetC78_1: C78.1 U13.A11(VREF)
NetU13_C9: U13.C9(DATOUT) U19.7(NC2)
NetU13_C15: U13.C15(MIC2_N/DMIC2IN) U14.2(NO1) U14.7(NC2)
NetU13_D6: U13.D6(BCLK) U20.7(NC2)
NetU13_D8: U13.D8(WCLK) U19.5(NC1)

Not connected (* = marked no-connect by the designer): R33 3 4; U15 2(SDx) 3(SCx) 10(OCSA) 11(SDOA); U18 2(1A1) 4(1A2) 16(1B2) 18(1B1); U20 2(NO1) 3(COM1) 5(NC1)

### Notes on the sheet
- Audio CODEC
- (near U12) Quiescent Current - 0.012 mA
- (near C63) +2.5V
- STBY 0V
- Microphone amplifier current - 0.050 mA
- VDD_IO Supply voltage:
  1.8...3.6 V
  Max power consumption:
  Stereo record
  +3V3  - 0.75 mA (Sample rate=48 kHz)
  Standby
  +3V3  - 0.003 mA
- (near U13) STBY 3.3V
- STBY 3.3V
- (near U13) STBY 0V
- (near U20) STBY 0V
- 6D sensor
- uSD CARD
- uSD Card
- Supply voltage:
  1.7...3.6 V
  Max power consumption:
  +3V3  - 0.75 mA
  Standby
  +3V3  - 0.01 mA
- (near U15) STBY 3.3V
- SCI7
- Max power consumption:
  Active write
  +3V3  - 24 mA
  Standby
  +3V3  - 0.36 mA

### Library data of the parts
C54 C55 C58 C59 C64-C66 C74-C76 C78 C79 = TMK105BJ105MV-F: as C80 on sheet S7_RF; Voltage - Rated: 25V; Part Number: TMK105BJ105MV-F; Distributor: Digi-Key; PartName: TMK105BJ105MV-F; Price: 0.22000; Tolerance: ±20%; Temperature Coefficient: X5R; Operating Temperature: -55°C ~ 85°C; Features: -; Package / Case: 0402 (1005 Metric)
C63 C68 C71 C72 C77 C82 C88 = 0402B104K500CT: as C4 on sheet S7_Power; Voltage - Rated: 50V; Part Number: 0402B104K500CT; Distributor: Digi-Key; PartName: 0402B104K500CT; Price: 0.19000; Tolerance: ±10%; Temperature Coefficient: X7R; Operating Temperature: -55°C ~ 125°C; Features: -; Package / Case: 0402 (1005 Metric)
C83 C84 = GRT188R61C106KE13D: as C1 on sheet S7_Power; Voltage - Rated: 16V; Part Number: GRT188R61C106KE13D; Distributor: Digi-Key; PartName: GRT188R61C106KE13D; Price: 0.22770; Tolerance: ±10%; Temperature Coefficient: X5R; Operating Temperature: -55°C ~ 85°C; Features: -; Package / Case: 0603 (1608 Metric)
P_MIC1 P_MIC2 P_MIC_BIAS1 P_MIC_GND1 = PIN_TOP_1.5x2: Pin on TOP layer 1.5 x 2 mm
R33 R44 = EXB-28V223JX: 22k Ohm ±5%,  4 Resistor, -55°C ~ 125°C,(2.00mm x 1.00mm); Manufacturer: Panasonic Electronic Components; PartNum: Y7223CT-ND; Distributor: Digi-Key; Price: 0.1$; Tolerance: 5%; Value: 22 k; PartName: EXB-28V223JX
R35 = RMCF0402FT10K0: 10 kOhms, ±1%, 0.063W, 1/16W, Thick Film, ±100ppm/°C, 0402 (1005 Metric), -55°C ~ 155°C, Automotive AEC-Q200; Manufacturer: Stackpole Electronics Inc; PartNum: RMCF0402FT10K0CT-ND; Voltage: 75V; Distributor: Digi-Key; Price: 0.10000; Tolerance: ±1%; PartName: RMCF0402FT10K0; Part Number: RMCF0402FT10K0; Temperature Coefficient: ±100ppm/°C; Operating Temperature: -55°C ~ 155°C; Power (Watts): 0.063W, 1/16W; Features: Automotive AEC-Q200; Package / Case: 0402 (1005 Metric)
U12 = NCP163AMX250TBG: LDO 2.5V, 250 mA, Vin < 5.5V, Iq < 20uA, -40..+125 C,  4-XDFN (1x1); Manufacturer: ON Semiconductor; PartNum: NCP163AMX250TBGOSCT-ND; Price: 0.41$; Distributor: Digi-Key; PartName: NCP163AMX250TBG
U13 = DA7217-00U32: Low power CODEC, 24 b, 2/2, I²C, I²S,  1.5V ~ 3.6V,  -25°C ~ 85°C, 34-WLCSP (4.57x1.98); Manufacturer: Dialog Semiconductor GmbH; PartNum: 1564-1043-1-ND; Price: 2.38$; Distributor: Digi-Key; PartName: DA7217-00U32
U14 U19 U20 = TS3A5223RSWR: 2 Circuit IC Switch 2:1 600 mOhm,-40°C ~ 85°C, 10-UQFN (1.8x1.4); Manufacturer: Texas Instruments; PartNum: 296-35687-1-ND; Distributor: Digi-Key; PartName: TS3A5223RSWR
U15 = ISM330DLCTR: Accelerometer, Gyroscope, Temperature, 3 Axis Sensor I²C, SPI , -40°C ~ 85°C, 14-LGA (2.5x3); Manufacturer: STMicroelectronics; PartNum: 497-17583-1-ND; Price: 6.28$; Distributor: Digi-Key; PartName: ISM330DLCTR
U18 = SN74CB3Q3244RGYR: Bus Switch 4 x 1:1, 2.3V ~ 3.6V,  -40°C ~ 85°C, 20-VQFN (3.5x4.5); Manufacturer: Texas Instruments; PartNum: 296-19127-1-ND; Distributor: Digi-Key; PartName: SN74CB3Q3244RGYR; Price: 1.08$
uSD1 = 2908-05WB-MG: microSD cadr holder; Manufacturer: Amphenol Commercial Products; PartNum: 101-00660-68-6-1-ND; PartName: 101-00660-68-6; Price: 1.97$; Distributor: Digi-Key

## Sheet S7_Misc.SchDoc
size A3
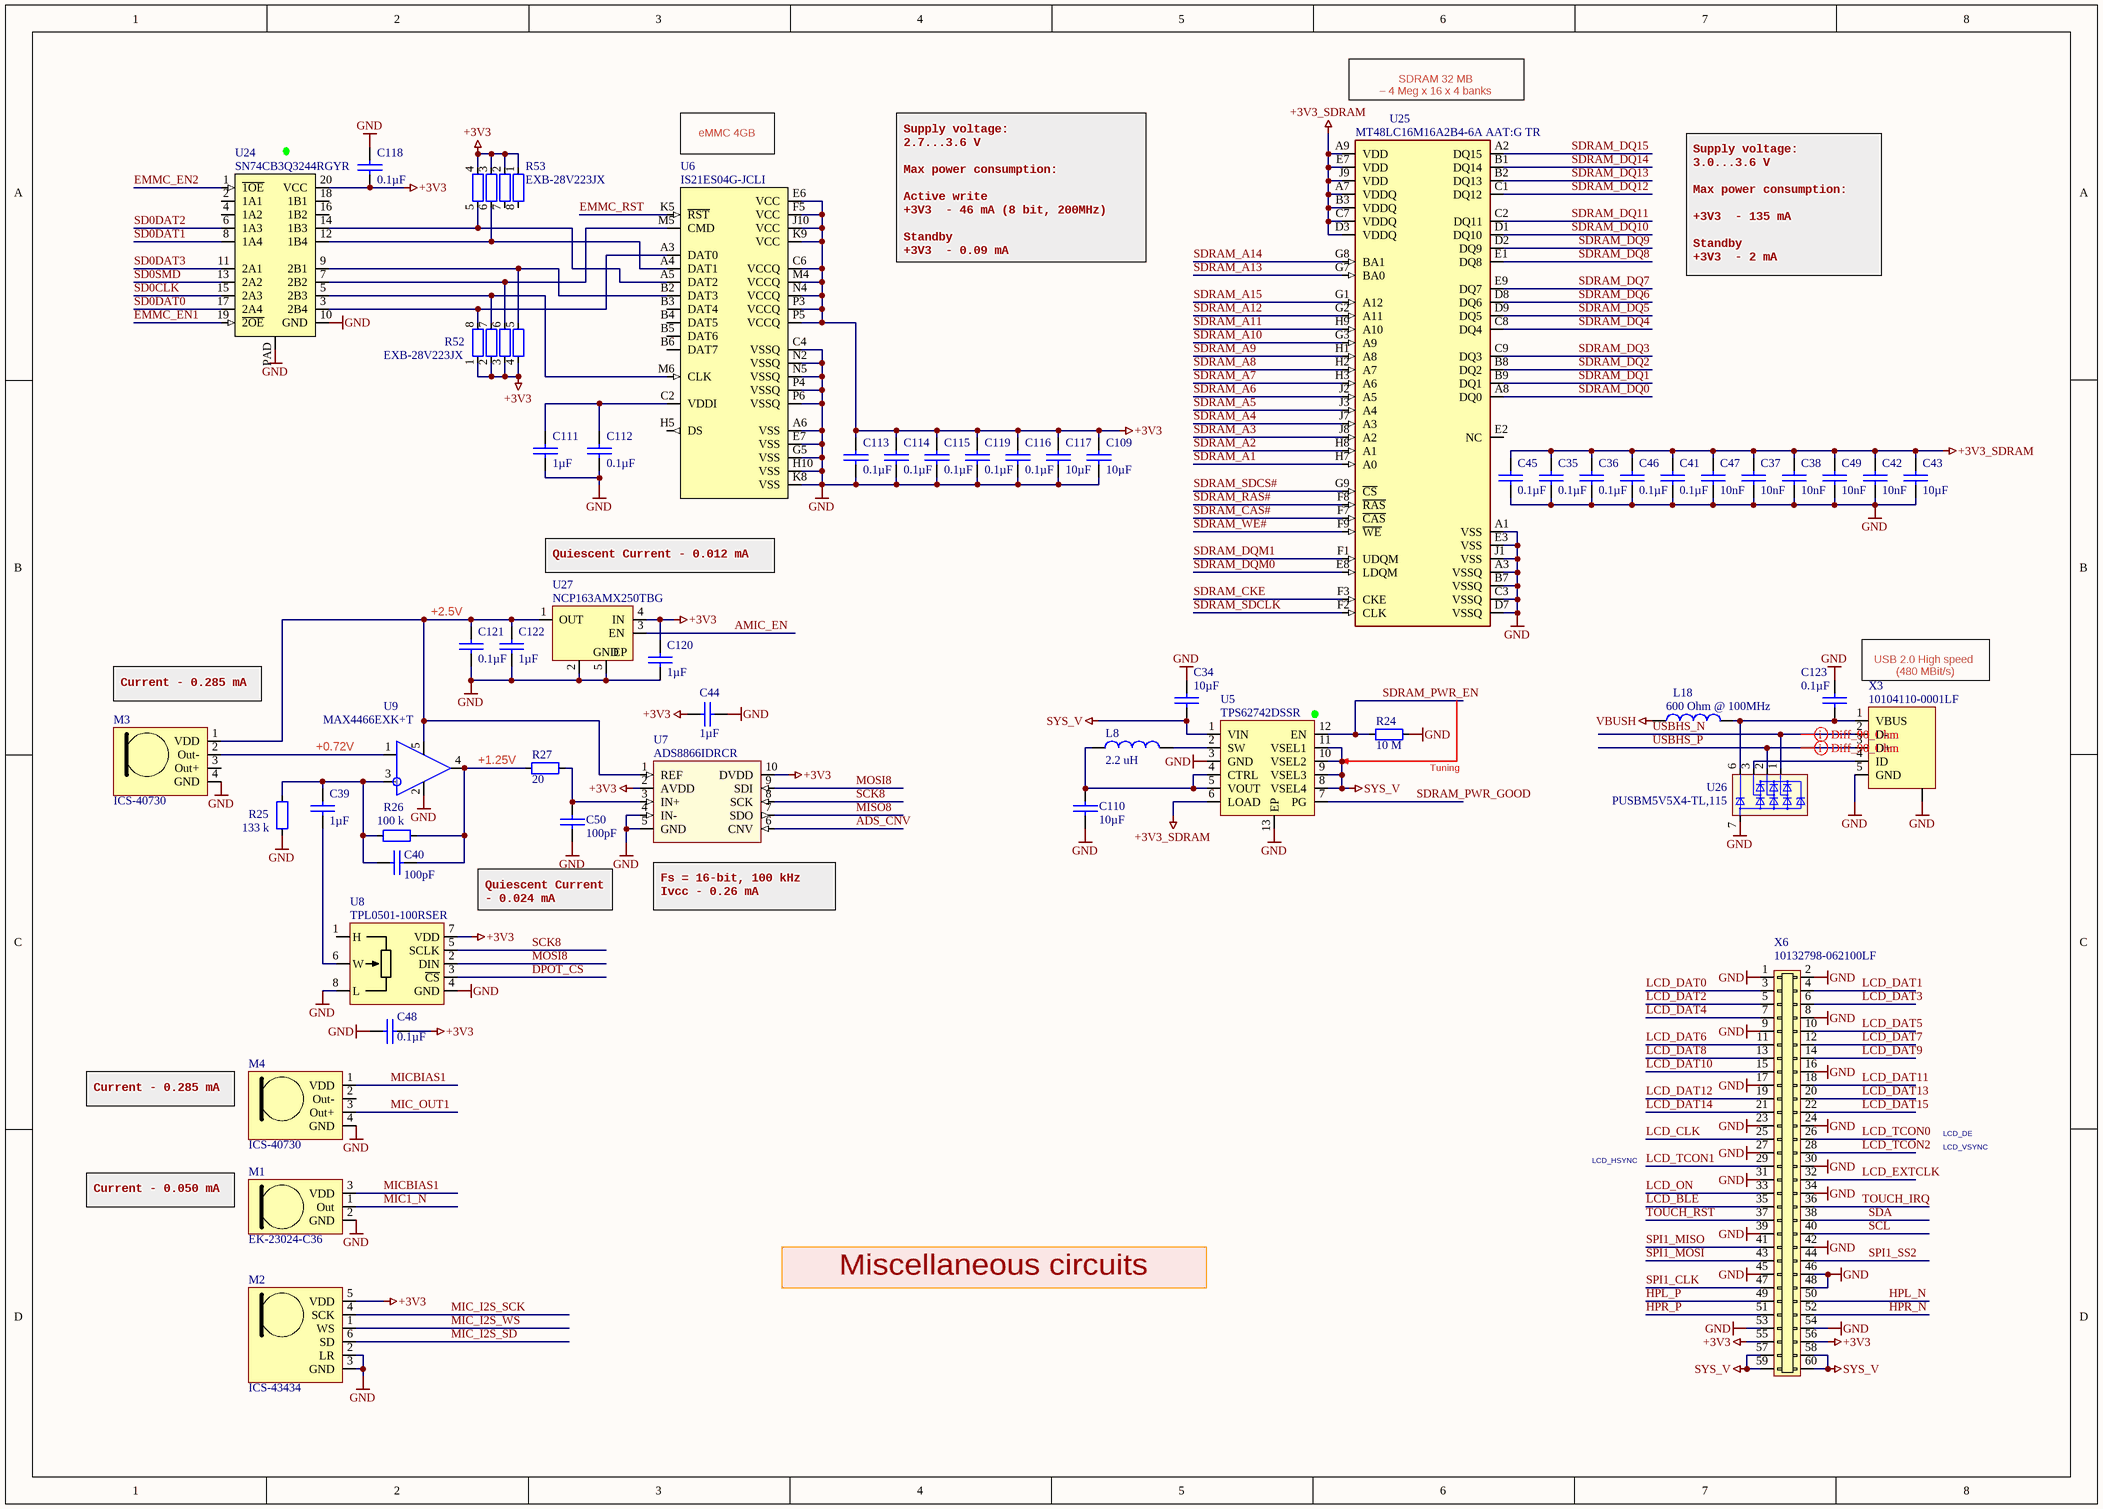
[diagram p4: S7_Misc.SchDoc]

### Parts
C34  value 10µF  [0603 CAP]  (hidden comment: Capacitor)
C35  value 0.1µF  [0402 CAP]  (hidden comment: Capacitor)
C36  value 0.1µF  [0402 CAP]  (hidden comment: Capacitor)
C37  value 10nF  [0402 CAP]  (hidden comment: Capacitor)
C38  value 10nF  [0402 CAP]  (hidden comment: Capacitor)
C39  value 1µF  [0402 CAP]  (hidden comment: Capacitor)
C40  value 100pF  [0402 CAP]  (hidden comment: Capacitor)
C41  value 0.1µF  [0402 CAP]  (hidden comment: Capacitor)
C42  value 10nF  [0402 CAP]  (hidden comment: Capacitor)
C43  value 10µF  [0603 CAP]  (hidden comment: Capacitor)
C44  value 1µF  [0402 CAP]  (hidden comment: Capacitor)
C45  value 0.1µF  [0402 CAP]  (hidden comment: Capacitor)
C46  value 0.1µF  [0402 CAP]  (hidden comment: Capacitor)
C47  value 10nF  [0402 CAP]  (hidden comment: Capacitor)
C48  value 0.1µF  [0402 CAP]  (hidden comment: Capacitor)
C49  value 10nF  [0402 CAP]  (hidden comment: Capacitor)
C50  value 100pF  [0402 CAP]  (hidden comment: Capacitor)
C109  value 10µF  [0603 CAP]  (hidden comment: Capacitor)
C110  value 10µF  [0603 CAP]  (hidden comment: Capacitor)
C111  value 1µF  [0402 CAP]  (hidden comment: Capacitor)
C112  value 0.1µF  [0402 CAP]  (hidden comment: Capacitor)
C113  value 0.1µF  [0402 CAP]  (hidden comment: Capacitor)
C114  value 0.1µF  [0402 CAP]  (hidden comment: Capacitor)
C115  value 0.1µF  [0402 CAP]  (hidden comment: Capacitor)
C116  value 0.1µF  [0402 CAP]  (hidden comment: Capacitor)
C117  value 10µF  [0603 CAP]  (hidden comment: Capacitor)
C118  value 0.1µF  [0402 CAP]  (hidden comment: Capacitor)
C119  value 0.1µF  [0402 CAP]  (hidden comment: Capacitor)
C120  value 1µF  [0402 CAP]  (hidden comment: Capacitor)
C121  value 0.1µF  [0402 CAP]  (hidden comment: Capacitor)
C122  value 1µF  [0402 CAP]  (hidden comment: Capacitor)
C123  value 0.1µF  [0402 CAP]  (hidden comment: Capacitor)
L8  value 2.2 uH  [744025002]  (hidden comment: 744025002)
L18  value 600 Ohm @ 100MHz  [0805]  (hidden comment: MPZ2012S601AT000)
M1  EK-23024-C36  [EK-23024-C36]
M2  ICS-43434  [ICS-43434]
M3  ICS-40730  [ICS-40730]
M4  ICS-40730  [ICS-40730]
R24  value 10 M  [0402]  (hidden comment: Resistor)
R25  value 133 k  [0402]  (hidden comment: Resistor)
R26  value 100 k  [0402]  (hidden comment: Resistor)
R27  value 20  [0402]  (hidden comment: Resistor)
R52  EXB-28V223JX  [EXB28V 2x1 mm]
R53  EXB-28V223JX  [EXB28V 2x1 mm]
U5  TPS62742DSSR  [12-WSON]
U6  IS21ES04G-JCLI  [MICRON_WFBGA153]
U7  ADS8866IDRCR  [TI S-PVSON-N10]
U8  TPL0501-100RSER  [UQFN-8]
U9  MAX4466EXK+T  [SOT-353 ON Semi]
U24  SN74CB3Q3244RGYR  [TI_PVQFN-N20]
U25  MT48LC16M16A2B4-6A AAT:G TR  [MICRON_VFBGA54]
U26  PUSBM5V5X4-TL,115  [DFN1616-6]
U27  NCP163AMX250TBG  [4-XDFN]
X3  10104110-0001LF  [FCI micro USB B receptacle SMD]
X6  10132798-062100LF  [10132798-062100LF]

### Nets
+3V3: C44.1 C48.2 C109.1 C113.1 C114.1 C115.1 C116.1 C117.1 C118.2 C119.1 C120.1 M2.5(VDD) R52.1 R52.2 R52.3 R52.4 R53.1 R53.2 R53.3 R53.4 U6.C6(VCCQ) U6.E6(VCC) U6.F5(VCC) U6.J10(VCC) U6.K9(VCC) U6.M4(VCCQ) U6.N4(VCCQ) U6.P3(VCCQ) U6.P5(VCCQ) U7.2(AVDD) U7.10(DVDD) U8.7(VDD) U24.20(VCC) U27.4(IN) X6.55 X6.56
+3V3_SDRAM: C35.1 C36.1 C37.1 C38.1 C41.1 C42.1 C43.1 C45.1 C46.1 C47.1 C49.1 U5.6(LOAD) U25.A7(VDDQ) U25.A9(VDD) U25.B3(VDDQ) U25.C7(VDDQ) U25.D3(VDDQ) U25.E7(VDD) U25.J9(VDD)
GND: C34.1 C35.2 C36.2 C37.2 C38.2 C41.2 C42.2 C43.2 C44.2 C45.2 C46.2 C47.2 C48.1 C49.2 C50.1 C109.2 C110.1 C111.2 C112.2 C113.2 C114.2 C115.2 C116.2 C117.2 C118.1 C119.2 C120.2 C121.2 C122.2 C123.1 M1.2(GND) M2.2(LR) M2.3(GND) M3.4(GND) M4.4(GND) R24.2 R25.1 U5.3(GND) U5.13(EP) U6.A6(VSS) U6.C4(VSSQ) U6.E7(VSS) U6.G5(VSS) U6.H10(VSS) U6.K8(VSS) U6.N2(VSSQ) U6.N5(VSSQ) U6.P4(VSSQ) U6.P6(VSSQ) U7.4(IN-) U7.5(GND) U8.4(GND) U8.8(L) U9.2(GND) U24.10(GND) U24.PAD U25.A1(VSS) U25.A3(VSSQ) U25.B7(VSSQ) U25.C3(VSSQ) U25.D7(VSSQ) U25.E3(VSS) U25.J1(VSS) U26.7 U27.2(GND) U27.5(EP) X3.5(GND) X3.G1(CASE) X6.1 X6.2 X6.8 X6.9 X6.16 X6.17 X6.23 X6.24 X6.27 X6.30 X6.31 X6.34 X6.39 X6.42 X6.45 X6.46 X6.48 X6.53 X6.54
SYS_V: C34.2 U5.1(VIN) U5.8(VSEL4) U5.9(VSEL3) U5.10(VSEL2) U5.11(VSEL1) X6.57 X6.58 X6.59 X6.60
VBUSH: L18.2
ADS_CNV: U7.6(CNV)
AMIC_EN: U27.3(EN)
DPOT_CS: U8.3(~{CS})
EMMC_EN1: U24.19(~{2OE})
EMMC_EN2: U24.1(~{1OE})
EMMC_RST: U6.K5(~{RST})
HPL_N: X6.50
HPL_P: X6.49
HPR_N: X6.52
HPR_P: X6.51
LCD_BLE: X6.35
LCD_CLK: X6.25
LCD_DAT0: X6.3
LCD_DAT1: X6.4
LCD_DAT2: X6.5
LCD_DAT3: X6.6
LCD_DAT4: X6.7
LCD_DAT5: X6.10
LCD_DAT6: X6.11
LCD_DAT7: X6.12
LCD_DAT8: X6.13
LCD_DAT9: X6.14
LCD_DAT10: X6.15
LCD_DAT11: X6.18
LCD_DAT12: X6.19
LCD_DAT13: X6.20
LCD_DAT14: X6.21
LCD_DAT15: X6.22
LCD_EXTCLK: X6.32
LCD_ON: X6.33
LCD_TCON0: X6.26
LCD_TCON1: X6.29
LCD_TCON2: X6.28
MIC1_N: M1.1(Out)
MIC_I2S_SCK: M2.4(SCK)
MIC_I2S_SD: M2.6(SD)
MIC_I2S_WS: M2.1(WS)
MIC_OUT1: M4.3(Out+)
MICBIAS1: M1.3(VDD) M4.1(VDD)
MISO8: U7.7(SDO)
MOSI8: U7.9(SDI) U8.2(DIN)
SCK8: U7.8(SCK) U8.5(SCLK)
SCL: X6.40
SD0CLK: U24.15(2A3)
SD0DAT0: U24.17(2A4)
SD0DAT1: U24.8(1A4)
SD0DAT2: U24.6(1A3)
SD0DAT3: U24.11(2A1)
SD0SMD: U24.13(2A2)
SDA: X6.38
SDRAM_A1: U25.H7(A0)
SDRAM_A2: U25.H8(A1)
SDRAM_A3: U25.J8(A2)
SDRAM_A4: U25.J7(A3)
SDRAM_A5: U25.J3(A4)
SDRAM_A6: U25.J2(A5)
SDRAM_A7: U25.H3(A6)
SDRAM_A8: U25.H2(A7)
SDRAM_A9: U25.H1(A8)
SDRAM_A10: U25.G3(A9)
SDRAM_A11: U25.H9(A10)
SDRAM_A12: U25.G2(A11)
SDRAM_A13: U25.G7(BA0)
SDRAM_A14: U25.G8(BA1)
SDRAM_A15: U25.G1(A12)
SDRAM_CAS#: U25.F7(~{CAS})
SDRAM_CKE: U25.F3(CKE)
SDRAM_DQ0: U25.A8(DQ0)
SDRAM_DQ1: U25.B9(DQ1)
SDRAM_DQ2: U25.B8(DQ2)
SDRAM_DQ3: U25.C9(DQ3)
SDRAM_DQ4: U25.C8(DQ4)
SDRAM_DQ5: U25.D9(DQ5)
SDRAM_DQ6: U25.D8(DQ6)
SDRAM_DQ7: U25.E9(DQ7)
SDRAM_DQ8: U25.E1(DQ8)
SDRAM_DQ9: U25.D2(DQ9)
SDRAM_DQ10: U25.D1(DQ10)
SDRAM_DQ11: U25.C2(DQ11)
SDRAM_DQ12: U25.C1(DQ12)
SDRAM_DQ13: U25.B2(DQ13)
SDRAM_DQ14: U25.B1(DQ14)
SDRAM_DQ15: U25.A2(DQ15)
SDRAM_DQM0: U25.E8(LDQM)
SDRAM_DQM1: U25.F1(UDQM)
SDRAM_PWR_EN: R24.1 U5.12(EN)
SDRAM_PWR_GOOD: U5.7(PG)
SDRAM_RAS#: U25.F8(~{RAS})
SDRAM_SDCLK: U25.F2(CLK)
SDRAM_SDCS#: U25.G9(~{CS})
SDRAM_WE#: U25.F9(~{WE})
SPI1_CLK: X6.47
SPI1_MISO: X6.41
SPI1_MOSI: X6.43
SPI1_SS2: X6.44
TOUCH_IRQ: X6.36
TOUCH_RST: X6.37
USBHS_N: U26.1 X3.2(D-)
USBHS_P: U26.2 X3.3(D+)
NetC39_1: C39.1 C40.1 R25.2 R26.1 U9.3(IN-)
NetC39_2: C39.2 U8.6(W)
NetC40_2: C40.2 R26.2 R27.1 U9.4(OUT)
NetC50_2: C50.2 R27.2 U7.3(IN+)
NetC110_2: C110.2 L8.1 U5.4(CTRL) U5.5(VOUT)
NetC111_1: C111.1 C112.1 U6.C2(VDDI)
NetC121_1: C121.1 C122.1 M3.1(VDD) U7.1(REF) U9.5(VCC) U27.1(OUT)
NetC123_2: C123.2 L18.1 U26.6 X3.1(VBUS)
NetL8_2: L8.2 U5.2(SW)
NetM3_2: M3.2(Out-) U9.1(IN+)
NetR52_5: R52.5 U6.B2(DAT3) U24.9(2B1)
NetR52_6: R52.6 U6.M5(CMD) U24.7(2B2)
NetR52_7: R52.7 U6.M6(CLK) U24.5(2B3)
NetR52_8: R52.8 U6.A3(DAT0) U24.3(2B4)
NetR53_5: R53.5 U6.A5(DAT2) U24.14(1B3)
NetR53_6: R53.6 U6.A4(DAT1) U24.12(1B4)
NetU26_3: U26.3 X3.4(ID)

Not connected (* = marked no-connect by the designer): M3 3(Out+); M4 2(Out-); R53 7 8; U6 B3(DAT4) B4(DAT5) B5(DAT6) B6(DAT7) H5(DS); U8 1(H); U24 2(1A1) 4(1A2) 16(1B2) 18(1B1); U25 E2(NC)

### Layout directives
differential pair; rule Differential Pairs Routing [Pref Gap = 0.127mm    Min Gap  = 0.127mm    Max Gap  = 0.127mmPref Width = 0.138mm    Min Width  = 0.075mm    Max Width  = 0.138mm]: USBHS_N, USBHS_P

### Notes on the sheet
- SDRAM 32 MB
  – 4 Meg x 16 x 4 banks
- (near U6) eMMC 4GB
- Supply voltage:
  2.7...3.6 V
  Max power consumption:
  Active write
  +3V3  - 46 mA (8 bit, 200MHz)
  Standby
  +3V3  - 0.09 mA
- Supply voltage:
  3.0...3.6 V
  Max power consumption:
  +3V3  - 135 mA
  Standby
  +3V3  - 2 mA
- Quiescent Current - 0.012 mA
- (near C121) +2.5V
- (near M3) Current - 0.285 mA
- USB 2.0 High speed
  (480 MBit/s)
- +0.72V
- +1.25V
- (near R24) Tuning
- Quiescent Current - 0.024 mA
- (near U7) Fs = 16-bit, 100 kHz
  Ivcc - 0.26 mA
- Current - 0.285 mA
- LCD_HSYNC
- LCD_VSYNC
- LCD_DE
- Current - 0.050 mA
- Miscellaneous circuits

### Library data of the parts
C34 C43 C109 C110 C117 = GRT188R61C106KE13D: 10µF, ±10%, 16V, X5R, 0603 (1608 Metric), -55°C ~ 85°C, -, Automotive; Manufacturer: Murata Electronics North America; PartNum: 490-12317-1-ND; Voltage - Rated: 16V; Part Number: GRT188R61C106KE13D; Distributor: Digi-Key; PartName: GRT188R61C106KE13D; Price: 0.22770; Tolerance: ±10%; Temperature Coefficient: X5R; Operating Temperature: -55°C ~ 85°C; Features: -; Package / Case: 0603 (1608 Metric)
C35 C36 C41 C45 C46 C48 C112-C116 C118 C119 C121 C123 = 0402B104K500CT: 0.1µF, ±10%, 50V, X7R, 0402 (1005 Metric), -55°C ~ 125°C, -, General Purpose; Manufacturer: Walsin Technology Corporation; PartNum: 1292-1176-1-ND; Voltage - Rated: 50V; Part Number: 0402B104K500CT; Distributor: Digi-Key; PartName: 0402B104K500CT; Price: 0.19000; Tolerance: ±10%; Temperature Coefficient: X7R; Operating Temperature: -55°C ~ 125°C; Features: -; Package / Case: 0402 (1005 Metric)
C37 C38 C42 C47 C49 = CL05B103KB5NNNC: 10000pF, ±10%, 50V, X7R, 0402 (1005 Metric), -55°C ~ 125°C, -, General Purpose; Manufacturer: Samsung Electro-Mechanics; PartNum: 1276-1028-1-ND; Voltage - Rated: 50V; Part Number: CL05B103KB5NNNC; Distributor: Digi-Key; PartName: CL05B103KB5NNNC; Price: 0.10000; Tolerance: ±10%; Temperature Coefficient: X7R; Operating Temperature: -55°C ~ 125°C; Features: -; Package / Case: 0402 (1005 Metric)
C39 C44 C111 C120 C122 = TMK105BJ105MV-F: 1µF, ±20%, 25V, X5R, 0402 (1005 Metric), -55°C ~ 85°C, -, General Purpose; Manufacturer: Taiyo Yuden; PartNum: 587-3245-1-ND; Voltage - Rated: 25V; Part Number: TMK105BJ105MV-F; Distributor: Digi-Key; PartName: TMK105BJ105MV-F; Price: 0.22000; Tolerance: ±20%; Temperature Coefficient: X5R; Operating Temperature: -55°C ~ 85°C; Features: -; Package / Case: 0402 (1005 Metric)
C40 C50 = AC0402JRNPO9BN101: 100pF, ±5%, 50V, C0G, NP0, 0402 (1005 Metric), -55°C ~ 125°C, -, Automotive; Manufacturer: Yageo; PartNum: 311-3023-1-ND; Voltage - Rated: 50V; Part Number: AC0402JRNPO9BN101; Distributor: Digi-Key; PartName: AC0402JRNPO9BN101; Price: 0.10000; Tolerance: ±5%; Temperature Coefficient: C0G, NP0; Operating Temperature: -55°C ~ 125°C; Features: -; Package / Case: 0402 (1005 Metric)
L8 = 744025002: Inductors 2.2 uH, 1.8 A, 0.066 Ohms, ±20% -40°C ~ 125°C, 2.8 x 2.8 mm; Manufacturer: Wurth Electronics Inc; PartNum: 732-2613-1-ND; Distributor: Digi-Key; Tolerance: ±20%; PartName: 744025002
L18 = MPZ2012S601AT000: FERRITE BEAD 600 OHM, 0805, -55°C ~ 125°C; Manufacturer: TDK Corporation; PartNum: 445-2206-1-ND; Distributor: Digi-Key; Price: 0.05$; PartName: MPZ2012S601AT000
M1 = EK-23024-C36: 100Hz ~ 5.5kHz Analog Microphone Electret Condenser 0.9V ~ 10V Omnidirectional (-53dB ±2dB @ 74dB SPL) Solder Pads; Manufacturer: Knowles; PartNum: 423-1121-ND; Distributor: Digi-Key; Price: 19.3$; PartName: EK-23024-C36
M2 = ICS-43434: 60Hz ~ 20kHz Digital, I²S Microphone MEMS (Silicon) 1.65V ~ 3.63V Omnidirectional (-26 ±1dB @ 94dB SPL) Solder Pads; Manufacturer: TDK InvenSense; PartNum: 1428-1066-1-ND; Distributor: Digi-Key; PartName: ICS-43434
M3 M4 = ICS-40730: 25Hz ~ 20kHz Analog Microphone MEMS (Silicon) 1.5V ~ 3.63V Noise Cancelling (-32dB ±2dB @ 124dB SPL) Solder Pads; Manufacturer: TDK InvenSense; PartNum: 1428-1141-1-ND; Distributor: Digi-Key; PartName: ICS-40730
R24 = CRCW040210M0FKEDC: 10 MOhms, ±1%, 0.063W, 1/16W, Thick Film, ±100ppm/°C, 0402 (1005 Metric), -55°C ~ 155°C, -; Manufacturer: Vishay Dale; PartNum: 541-4068-1-ND; Voltage: 75V; Distributor: Digi-Key; Price: 0.10000; Tolerance: ±1%; PartName: CRCW040210M0FKEDC; Part Number: CRCW040210M0FKEDC; Temperature Coefficient: ±100ppm/°C; Operating Temperature: -55°C ~ 155°C; Power (Watts): 0.063W, 1/16W; Features: -; Package / Case: 0402 (1005 Metric)
R25 = RMCF0402FT133K: 133 kOhms, ±1%, 0.063W, 1/16W, Thick Film, ±100ppm/°C, 0402 (1005 Metric), -55°C ~ 155°C, Automotive AEC-Q200; Manufacturer: Stackpole Electronics Inc; PartNum: RMCF0402FT133KCT-ND; Voltage: 75V; Distributor: Digi-Key; Price: 0.10000; Tolerance: ±1%; PartName: RMCF0402FT133K; Part Number: RMCF0402FT133K; Temperature Coefficient: ±100ppm/°C; Operating Temperature: -55°C ~ 155°C; Power (Watts): 0.063W, 1/16W; Features: Automotive AEC-Q200; Package / Case: 0402 (1005 Metric)
R26 = RMCF0402FT100K: 100 kOhms, ±1%, 0.063W, 1/16W, Thick Film, ±100ppm/°C, 0402 (1005 Metric), -55°C ~ 155°C, Automotive AEC-Q200; Manufacturer: Stackpole Electronics Inc; PartNum: RMCF0402FT100KCT-ND; Voltage: 75V; Distributor: Digi-Key; Price: 0.10000; Tolerance: ±1%; PartName: RMCF0402FT100K; Part Number: RMCF0402FT100K; Temperature Coefficient: ±100ppm/°C; Operating Temperature: -55°C ~ 155°C; Power (Watts): 0.063W, 1/16W; Features: Automotive AEC-Q200; Package / Case: 0402 (1005 Metric)
R27 = RMCF0402FT20R0: 20 Ohms, ±1%, 0.063W, 1/16W, Thick Film, ±100ppm/°C, 0402 (1005 Metric), -55°C ~ 155°C, Automotive AEC-Q200; Manufacturer: Stackpole Electronics Inc; PartNum: RMCF0402FT20R0CT-ND; Voltage: 75V; Distributor: Digi-Key; Price: 0.10000; Tolerance: ±1%; PartName: RMCF0402FT20R0; Part Number: RMCF0402FT20R0; Temperature Coefficient: ±100ppm/°C; Operating Temperature: -55°C ~ 155°C; Power (Watts): 0.063W, 1/16W; Features: Automotive AEC-Q200; Package / Case: 0402 (1005 Metric)
R52 R53 = EXB-28V223JX: 22k Ohm ±5%,  4 Resistor, -55°C ~ 125°C,(2.00mm x 1.00mm); Manufacturer: Panasonic Electronic Components; PartNum: Y7223CT-ND; Distributor: Digi-Key; Price: 0.1$; Tolerance: 5%; Value: 22 k; PartName: EXB-28V223JX
U5 = TPS62742DSSR: DCDC 1.8-3.3V, 400mA , Iq=360nA, -40°C ~ 85°C, 12-WSON (3x2); Manufacturer: Texas Instruments; PartNum: 296-40852-1-ND; Distributor: Digi-Key; price: 1.93$; PartName: TPS62742DSSR
U6 = IS21ES04G-JCLI: 4GByte eMMC, 200MHz, 2.7V ~ 3.6V, 153-VFBGA (11.5x13),  -40°C ~ 85°C; Manufacturer: Integrated Silicon Solution Inc; Mfg Part Number: IS21ES04G-JCLI; Package: 153-VFBGA (11.5x13); Display Name: IS21ES04G-JCLI
U7 = ADS8866IDRCR: 16-bit ADC, 100k, Pseudo-Differential, Single Ended, 2.7..3.6V,  -40°C...85°C, 10-VSON; Manufacturer: Texas Instruments; PartNum: 296-39886-1-ND; Distributor: Digi-Key; PartName: ADS8866IDRCR
U8 = TPL0501-100RSER: Digital Potentiometer 100k Ohm 1 Circuit 256 Taps SPI Interface, -40°C ~ 125°C,  8-UQFN (1.5x1.5); Manufacturer: Texas Instruments; PartNum: 296-29585-1-ND; Distributor: Digi-Key; PartName: TPL0501-100RSER
U9 = MAX4466EXK+T: OpAmp, Class AB,  2.4V ~ 5.5V, -40°C ~ 85°C, SC-70-5; Manufacturer: Maxim Integrated; PartNum: MAX4466EXK+CT-ND; Distributor: Digi-Key; PartName: MAX4466EXK+T
U24 = SN74CB3Q3244RGYR: Bus Switch 4 x 1:1, 2.3V ~ 3.6V,  -40°C ~ 85°C, 20-VQFN (3.5x4.5); Manufacturer: Texas Instruments; PartNum: 296-19127-1-ND; Distributor: Digi-Key; PartName: SN74CB3Q3244RGYR; Price: 1.08$
U25 = MT48LC16M16A2B4-6A AAT:G TR: Micron SDRAM 256M-Bit 16Mx16, 3.3V, 167MHz, 5.4ns, -40°C ~ 105°C, 54-VFBGA (8x8); Manufacturer: Micron Technology Inc.; PartNum: 557-1932-1-ND; Distributor: Digi-Key; PartName: MT48LC16M16A2B4-6A AAT:G TR; Price: 10.7$; Supplier 1: Digi-Key; Supplier Part Number 1: 557-1932-1-ND
U26 = PUSBM5V5X4-TL,115: TVS DIODE 5.5VWM 12VC 6HXSON; Manufacturer: NXP Semiconductors; PartNum: 568-10921-1-ND; Distributor: Digi-Key; PartName: PUSBM5V5X4-TL,115
U27 = NCP163AMX250TBG: LDO 2.5V, 250 mA, Vin < 5.5V, Iq < 20uA, -40..+125 C,  4-XDFN (1x1); Manufacturer: ON Semiconductor; PartNum: NCP163AMX250TBGOSCT-ND; Price: 0.41$; Distributor: Digi-Key; PartName: NCP163AMX250TBG
X3 = 10104110-0001LF: USB - micro B USB 2.0 Receptacle Connector 5 Position Surface Mount, Right Angle; Manufacturer: Amphenol FCI; PartNum: 609-4052-1-ND; Distributor: Digi-Key; Price: 0.79$; PartName: 10104110-0001LF
X6 = 10132798-062100LF: 60 Position Connector Receptacle, Center Strip Contacts Surface Mount Gold, height 2.7 mm, pitch 0.5 mm; Manufacturer: Amphenol ICC (FCI); PartNum: 609-5230-1-ND; Distributor: Digi-Key; PartName: 10132798-062100LF